# EAGLE design frequency divider 1.2 (EAGLE 6.4)
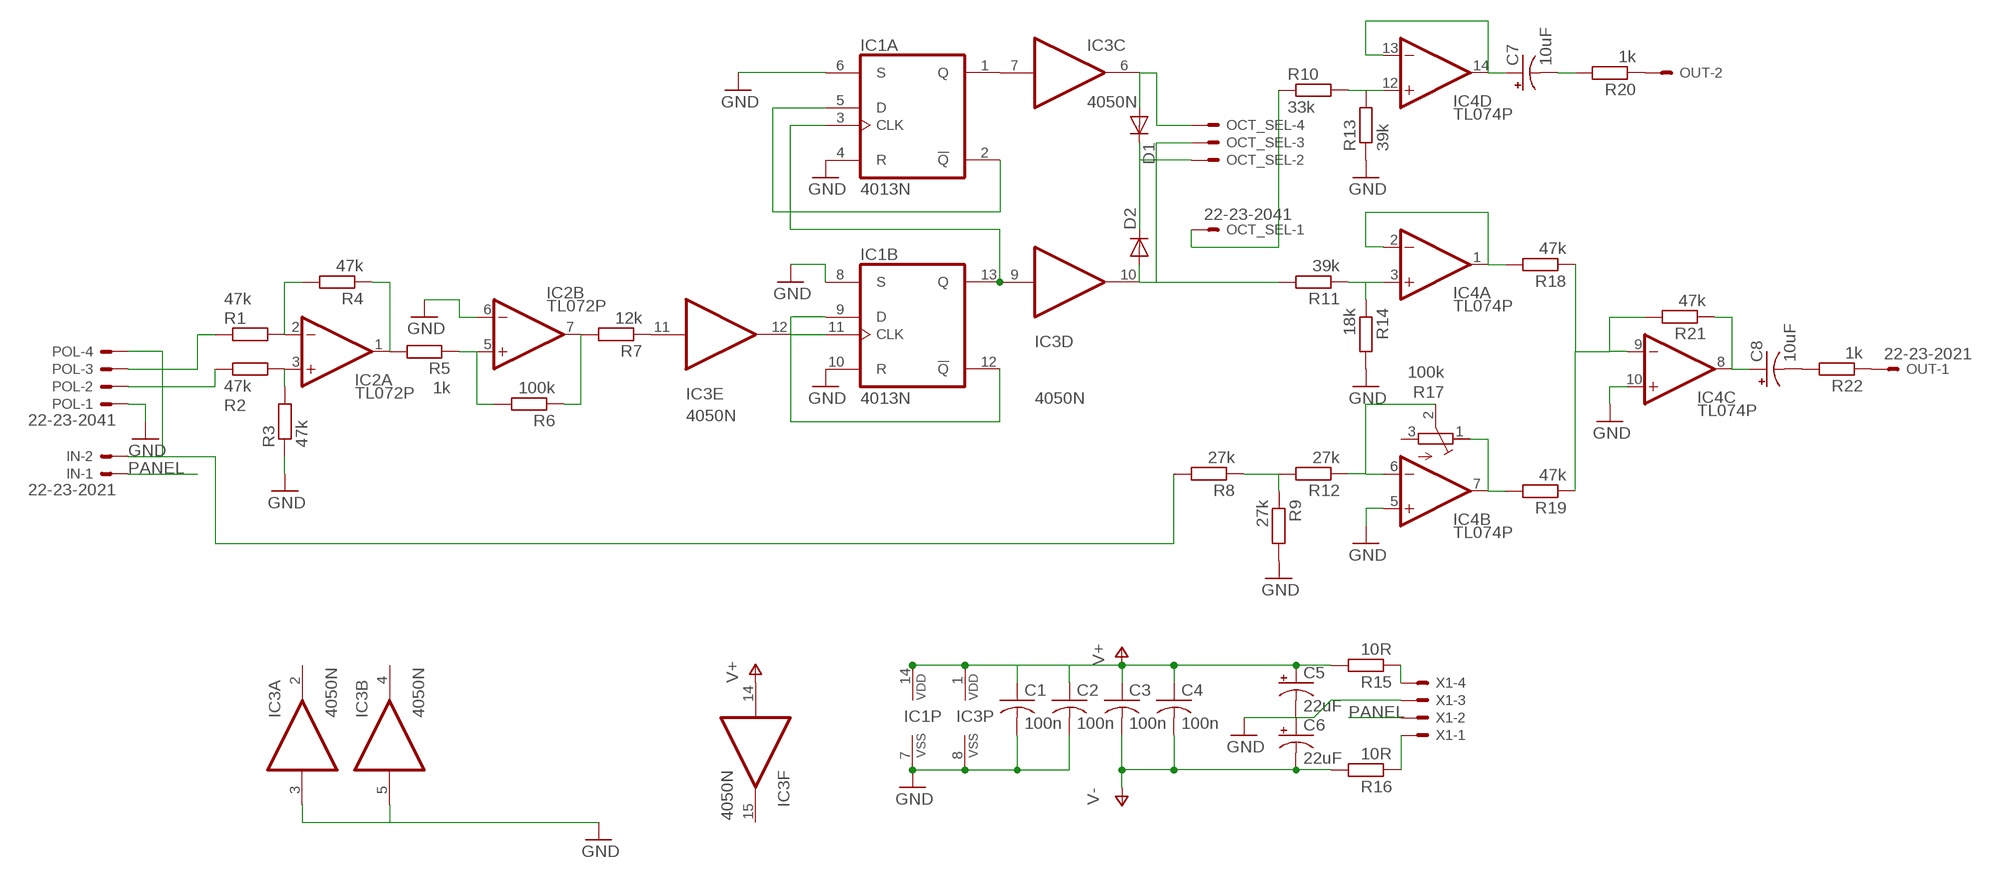
[diagram p0: schematic, sheet 1]

## Parts
C1  100n  C-US025-024X044  [C025-024X044]
C2  100n  C-US025-024X044  [C025-024X044]
C3  100n  C-US025-024X044  [C025-024X044]
C4  100n  C-US025-024X044  [C025-024X044]
C5  22uF  CPOL-USE2.5-5  [E2,5-5]
C6  22uF  CPOL-USE2.5-5  [E2,5-5]
C7  10uF  CPOL-USE2.5-5  [E2,5-5]
C8  10uF  CPOL-USE2.5-5  [E2,5-5]
D1  DIODE-D-5  [D-5]
D2  DIODE-D-5  [D-5]
IC1  4013N  [DIL14]
IC2  TL072P  [DIL08]
IC3  4050N  [DIL16]
IC4  TL074P  [DIL14]
IN  22-23-2021  [22-23-2021]
OCT_SEL  22-23-2041  [22-23-2041]
OUT  22-23-2021  [22-23-2021]
POL  22-23-2041  [22-23-2041]
R1  47k  R-EU_0204/7  [0204/7]
R2  47k  R-EU_0204/7  [0204/7]
R3  47k  R-EU_0204/7  [0204/7]
R4  47k  R-EU_0204/7  [0204/7]
R5  1k  R-EU_0204/7  [0204/7]
R6  100k  R-EU_0204/7  [0204/7]
R7  12k  R-EU_0204/7  [0204/7]
R8  27k  R-EU_0204/7  [0204/7]
R9  27k  R-EU_0204/7  [0204/7]
R10  33k  R-EU_0204/7  [0204/7]
R11  39k  R-EU_0204/7  [0204/7]
R12  27k  R-EU_0204/7  [0204/7]
R13  39k  R-EU_0204/7  [0204/7]
R14  18k  R-EU_0204/7  [0204/7]
R15  10R  R-EU_0204/7  [0204/7]
R16  10R  R-EU_0204/7  [0204/7]
R17  100k  R-TRIMMT93YA  [RTRIMT93YA]
R18  47k  R-EU_0204/7  [0204/7]
R19  47k  R-EU_0204/7  [0204/7]
R20  1k  R-EU_0204/7  [0204/7]
R21  47k  R-EU_0204/7  [0204/7]
R22  1k  R-EU_0204/7  [0204/7]
X1  KK-156-4  [KK-156-4]

## Nets
GND: C1.2 C2.2 C5.- C6.+ IC1.4(A:R) IC1.6(A:S) IC1.7(P:VSS) IC1.8(B:S) IC1.10(B:R) IC2.6(B:-IN) IC3.3(A:I) IC3.5(B:I) IC3.8(P:VSS) IC4.5(B:+IN) IC4.10(C:+IN) POL.1 R3.1 R9.2 R13.1 R14.2 X1.3
N$1: C7.- R20.2
N$2: C8.- R22.2
N$3: IC2.2(A:-IN) R1.2 R4.2
N$4: IC2.3(A:+IN) R2.2 R3.2
N$5: IC2.1(A:OUT) R4.1 R5.2
N$6: IC1.3(A:CLK) IC1.13(B:Q) IC3.9(D:I)
N$7: IC2.5(B:+IN) R5.1 R6.2
N$8: IC2.7(B:OUT) R6.1 R7.2
N$9: IC3.11(E:I) R7.1
N$10: IC1.11(B:CLK) IC3.12(E:O)
N$11: IC1.9(B:D) IC1.12(B:!Q)
N$12: D2.A IC3.10(D:O) OCT_SEL.3 R11.2
N$13: IC4.3(A:+IN) R11.1 R14.1
N$14: IC4.12(D:+IN) R10.2 R13.2
N$15: C7.+ IC4.13(D:-IN) IC4.14(D:OUT)
N$16: IC4.1(A:OUT) IC4.2(A:-IN) R18.2
N$17: IC4.6(B:-IN) R12.1 R17.2(S)
N$18: IC4.7(B:OUT) R17.1(A) R19.2
N$19: R15.1 X1.4
N$20: R8.1 R9.1 R12.2
N$21: IC4.9(C:-IN) R18.1 R19.1 R21.2
N$22: C8.+ IC4.8(C:OUT) R21.1
N$23: R16.1 X1.1
N$24: OUT.2 R20.1
N$25: IN.2 POL.4 R8.2
N$26: OUT.1 R22.1
N$31: POL.2 R2.1
N$32: POL.3 R1.1
N$33: IC1.2(A:!Q) IC1.5(A:D)
N$34: IC1.1(A:Q) IC3.7(C:I)
N$36: D1.A IC3.6(C:O) OCT_SEL.4
N$37: D1.C D2.C OCT_SEL.2
N$38: OCT_SEL.1 R10.1
PANEL: IN.1 X1.2
V+: C1.1 C2.1 C3.1 C4.1 C5.+ IC1.14(P:VDD) IC3.1(P:VDD) IC3.14(F:I) R15.2
V-: C3.2 C4.2 C6.- R16.2
Unconnected: IC3.2(A:O) IC3.4(B:O) IC3.15(F:O) R17.3(E)

## Power pins joined to a net without a drawn wire
V+: IC2.8(P:V+) IC4.4(P:V+)
V-: IC2.4(P:V-) IC4.11(P:V-)

## Library data of the parts
C1-C4 = resistor:C-US: CAPACITOR, American symbol
C5-C8 = resistor:CPOL-US: POLARIZED CAPACITOR, American symbol
D1 D2 = diode:DIODE-: DIODE
IC1 = joakim:4013: Dual D FLIP FLOP, set/reset
IC2 = linear:TL072: OP AMP
IC3 = joakim:4050: Hex non-inverting BUFFER
IC4 = linear:TL074: OP AMP
IN OUT = con-molex:22-23-2021: .100" (2.54mm) Center Header - 2 Pin; MF: MOLEX; MPN: 22-23-2021; OC_FARNELL: 1462926; OC_NEWARK: 25C3832
OCT_SEL POL = con-molex:22-23-2041: .100" (2.54mm) Center Header - 4 Pin; MF: MOLEX; MPN: 22-23-2041; OC_FARNELL: 1462920; OC_NEWARK: 38C0355
R1-R10 R12-R16 R18-R22 = joakim:R-EU_: RESISTOR, European symbol
R11 = resistor:R-EU_: RESISTOR, European symbol
R17 = resistor:R-TRIMM: Trimm resistor
X1 = con-molex:KK-156-4: KK 156 HEADER Source: http://www.molex.com/pdm_docs/sd/026604100_sd.pdf; OC_FARNELL: unknown; OC_NEWARK: unknown

## Board
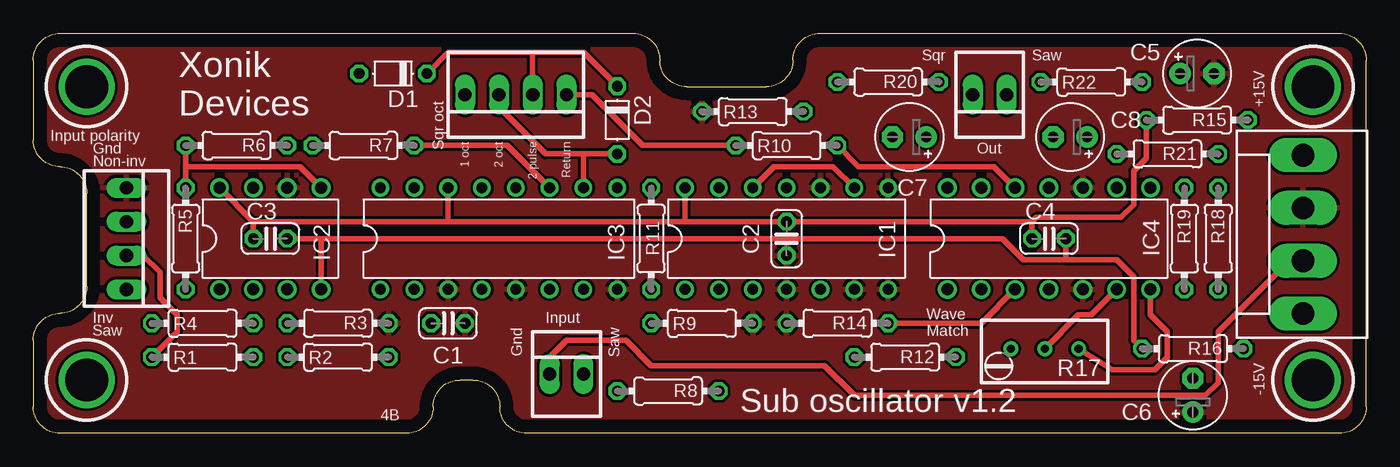
[diagram p1: board, top side]
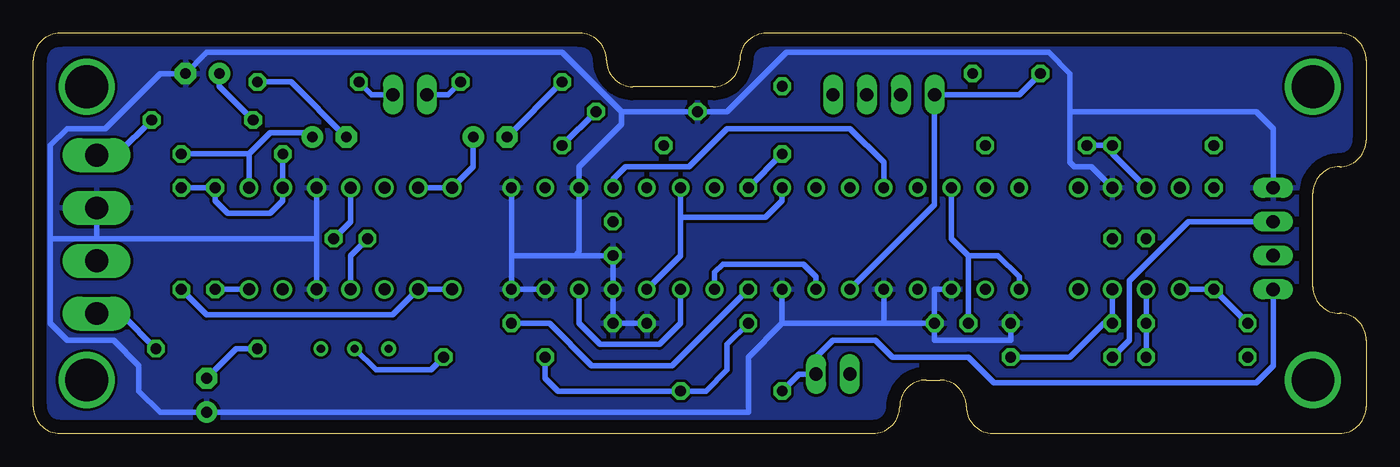
[diagram p2: board, bottom side, seen from below]

Size 100 x 30 mm. Coordinates in mm from the lower left corner, seen from the top.
Outline: 0,28 arc-90 2,30 45,30 arc-90 47,28 arc90 49,26 55,26 arc90 57,28 arc-90 59,30 98,30 arc-90 100,28 100,2 arc-90 98,0 37,0 arc-90 35,2 arc90 33,4 32,4 arc90 30,2 arc-90 28,0 2,0 arc-90 0,2 0,7 arc-90 2,9 arc90 4,11 4,18 arc90 2,20 arc-90 0,22 0,28
Copper layers (1*16): Top 0.035mm / dielectric 1.5mm / Bottom 0.035mm
Design rules "default": minimum track width 10mil, minimum drill 24mil, track to track 8mil, track to pad 8mil, pad to pad 8mil, via to via 8mil, smd to smd 8mil, copper to edge 40mil, drill to drill 8mil, minimum pad ring 10mil, minimum via ring 8mil, stop-mask expansion 4mil, vias tented up to drill 0mil, thermal gap 10mil

### Footprints (pad centres in the part's own frame; a part is rotated, then mirrored left to right if it is on the bottom)
C025-024X044 = drill 0.813 octagon: 1 -1.27,0; 2 1.27,0
E2,5-5 = drill 0.813 pad 1.6: + -1.27,0 | drill 0.813 pad 1.6 octagon: - 1.27,0
D-5 = drill 0.813 octagon: A 2.54,0; C -2.54,0
DIL14 = drill 0.813: 1 -7.62,-3.81; 2 -5.08,-3.81; 3 -2.54,-3.81; 4 0,-3.81; 5 2.54,-3.81; 6 5.08,-3.81; 7 7.62,-3.81; 8 7.62,3.81; 9 5.08,3.81; 10 2.54,3.81; 11 0,3.81; 12 -2.54,3.81; 13 -5.08,3.81; 14 -7.62,3.81
DIL08 = drill 0.9: 1 -3.81,-3.81; 2 -1.27,-3.81; 3 1.27,-3.81; 4 3.81,-3.81; 5 3.81,3.81; 6 1.27,3.81; 7 -1.27,3.81; 8 -3.81,3.81
DIL16 = drill 0.813: 1 -8.89,-3.81; 2 -6.35,-3.81; 3 -3.81,-3.81; 4 -1.27,-3.81; 5 1.27,-3.81; 6 3.81,-3.81; 7 6.35,-3.81; 8 8.89,-3.81; 9 8.89,3.81; 10 6.35,3.81; 11 3.81,3.81; 12 1.27,3.81; 13 -1.27,3.81; 14 -3.81,3.81; 15 -6.35,3.81; 16 -8.89,3.81
DIL14' = drill 0.9: 1 -7.62,-3.81; 2 -5.08,-3.81; 3 -2.54,-3.81; 4 0,-3.81; 5 2.54,-3.81; 6 5.08,-3.81; 7 7.62,-3.81; 8 7.62,3.81; 9 5.08,3.81; 10 2.54,3.81; 11 0,3.81; 12 -2.54,3.81; 13 -5.08,3.81; 14 -7.62,3.81
22-23-2021 = drill 1 long: 1 -1.27,0; 2 1.27,0
22-23-2041 = drill 1 long: 1 -3.81,0; 2 -1.27,0; 3 1.27,0; 4 3.81,0
0204/7 = drill 0.813 octagon: 1 -3.81,0; 2 3.81,0
RTRIMT93YA = drill 0.61: 1 0,-2.54; 2 0,0; 3 0,2.54
KK-156-4 = drill 1.7 pad 2.184 long: 1 -5.94,0; 2 -1.98,0; 3 1.98,0; 4 5.94,0

### Placement (x,y rotation side)
C1  31.11,8.26 0 top
C2  56.52,14.61 270 top
C3  17.78,14.61 0 top
C4  76.2,14.61 0 top
C5  87.31,26.99 0 top
C6  87,2.86 90 top
C7  65.72,22.23 180 top
C8  77.79,22.23 180 top
D1  26.99,26.99 180 top
D2  43.81,23.5 270 top
IC1  56.52,14.61 0 top
IC2  17.78,14.61 0 top
IC3  34.92,14.61 0 top
IC4  TL074P  [DIL14']  76.2,14.61 0 top
IN  40.01,4.45 0 top
OCT_SEL  36.2,25.4 180 top
OUT  71.75,25.4 180 top
POL  6.99,14.61 270 top
R1  12.7,5.71 0 top
R2  22.86,5.71 0 top
R3  22.86,8.26 180 top
R4  12.7,8.26 0 top
R5  11.43,14.61 270 top
R6  15.24,21.59 180 top
R7  24.77,21.59 180 top
R8  47.62,3.17 180 top
R9  50.16,8.26 0 top
R10  56.52,21.59 0 top
R11  46.35,14.61 90 top
R12  65.41,5.71 180 top
R13  53.98,24.13 0 top
R14  60.33,8.26 180 top
R15  87.31,23.5 180 top
R16  87,6.35 180 top
R17  75.88,6.35 90 top
R18  88.9,14.61 270 top
R19  86.36,14.61 270 top
R20  64.14,26.35 180 top
R21  85.09,20.95 180 top
R22  79.38,26.35 0 top
X1  95.25,14.92 90 top

### Tracks (layer width: path | path; a pad name or v marks a point on that pad's centre or on a via)
GND
  Bottom 0.406: 43.81,8.26 36.2,8.26 | 36.2,8.26 C1.2 | 55.88,24.13 55.88,23.18 59.05,20 IC1.10 59.05,13.65 59.37,13.34 | R3.1 26.67,6.99 32.38,6.99 C1.2 | IC2.6 20.64,20 21.91,20 22.23,20.32 22.23,24.13 | 22.23,24.13 8.26,24.13 6.99,22.86 POL.1 | 43.81,8.26 46.35,5.71 46.35,1.59 C6.+ 90.49,1.59 92.08,3.17 92.08,5.08 93.98,6.99 97.47,6.99 98.74,8.26 98.74,14.61 | 22.23,24.13 22.23,26.99 23.81,28.57 43.5,28.57 47.94,24.13 R13.1 55.88,24.13 | IC4.10 78.74,14.61 | 78.74,14.61 IC4.5 | 98.74,14.61 98.74,21.59 97.47,22.86 94.61,22.86 90.49,26.99 C5.- 87,28.57 60.33,28.57 55.88,24.13 | X1.3 95.25,14.61 | 95.25,14.61 78.74,14.61 | 95.25,14.61 98.74,14.61 | IC3.8 43.81,8.26 | C1.2 32.38,10.79 IC3.3 | IC3.5 36.2,8.26 | R9.2 R14.2 IC1.4 C2.2 59.37,13.34 | IC1.6 IC1.7 64.14,13.34 | 59.37,13.34 64.14,13.34 | 64.14,13.34 IC1.8
  pour Top: 0,30 100,30 100,0 0,0
  pour Bottom: 0,30 100,30 100,0 0,0
N$1
  Bottom 0.406: R20.2 C7.-
N$2
  Bottom 0.406: R22.2 80.64,26.35 C8.-
N$3
  Bottom 0.406: IC2.2 R4.2 R1.2
N$4
  Bottom 0.406: IC2.3 R3.2 19.68,8.26 22.23,5.71 R2.2
N$5
  Bottom 0.406: R4.1 R5.2 IC2.1
N$6
  Bottom 0.406: IC1.13 51.44,16.19 | 51.44,16.19 45.09,16.19 43.81,17.46 IC3.9 | 51.44,16.19 51.44,13.34 IC1.3
N$7
  Top 0.406: R5.1 11.43,20 | 11.43,20 20,20 IC2.5 | R6.2 11.43,20
N$8
  Bottom 0.406: IC2.7 19.05,20.95 R6.1 R7.2
N$9
  Top 0.406: R7.1 35.56,21.59 IC3.11
N$10
  Bottom 0.406: IC1.11 56.52,19.05 55.56,20 50.8,20 47.94,22.86 38.73,22.86 36.2,20.32 IC3.12
N$11
  Top 0.406: IC1.12 55.56,20 60.01,20 IC1.9
N$12
  Top 0.406: D2.A 41.27,20.95 | 41.27,20.95 38.42,20.95 34.92,24.45 OCT_SEL.3 | IC3.10 41.27,20.95
  Bottom 0.406: D2.A R11.2
N$13
  Top 0.406: R14.1 71.12,8.26 IC4.3
  Bottom 0.406: R11.1 52.07,5.08 58.1,5.08 61.28,8.26 R14.1
N$14
  Top 0.406: R10.2 61.91,20 72.07,20 IC4.12
  Bottom 0.406: R13.2 R10.2
N$15
  Bottom 0.406: IC4.13 IC4.14 66.99,20 C7.+
N$16
  Bottom 0.406: IC4.1 IC4.2 73.03,8.89 87,8.89 R18.2
N$17
  Top 0.406: R17.2 78.42,8.89 79.38,8.89 IC4.6
  Bottom 0.406: R12.1 70.17,4.76 74.3,4.76 R17.2
N$18
  Top 0.406: R17.1 80.96,4.76 84.14,4.76 85.09,5.71 85.09,7.62 83.82,8.89 IC4.7
  Bottom 0.406: IC4.7 R19.2
N$19
  Bottom 0.406: R15.1 93.66,20.95 95.16,20.95 X1.4
N$20
  Bottom 0.406: R12.2 61.59,4.13 60.64,3.17 R8.1 49.53,3.17 47.94,4.76 47.94,6.67 R9.1
N$21
  Bottom 0.406: R21.2 IC4.9 81.28,17.46 82.23,16.51 85.41,16.51 86.36,17.46 R19.1 R18.1
N$22
  Bottom 0.406: IC4.8 83.82,20.95 | 83.82,20.95 R21.1 | C8.+ 79.38,22.54 82.23,22.54 83.82,20.95
N$23
  Bottom 0.406: R16.1 93.34,8.89 95.16,8.89 X1.1
N$24
  Bottom 0.406: R20.1 68.9,25.4 OUT.2
N$25
  Bottom 0.406: R8.2 42.55,4.45 IN.2 41.27,5.71 40.01,6.99 36.83,6.99 35.56,5.71 29.84,5.71 27.94,3.81 8.26,3.81 6.99,5.08 POL.4
N$26
  Bottom 0.406: R22.1 74.61,25.4 OUT.1
N$27  (via drill 3.2)
  other vias: 4,4
N$28  (via drill 3.2)
  other vias: 4,26
N$29  (via drill 3.2)
  other vias: 96,26
N$30  (via drill 3.2)
  other vias: 96,4
N$31
  Bottom 0.406: R2.1 17.78,6.99 17.78,11.43 13.34,15.88 POL.2
N$32
  Top 0.406: R1.1 10.79,7.62 10.79,8.89 9.53,10.16 9.53,12.06 8.26,13.34 POL.3
N$33
  Bottom 0.406: IC1.2 51.44,8.26 53.02,6.67 57.47,6.67 59.05,8.26 IC1.5
N$34
  Bottom 0.406: IC1.1 48.9,12.06 48.26,12.7 42.23,12.7 41.27,11.75 IC3.7
N$36
  Bottom 0.406: D1.A 26.04,25.4 OCT_SEL.4 32.38,17.14 IC3.6
N$37
  Top 0.406: D1.C 31.11,28.57 37.47,28.57 | 37.47,28.57 41.27,28.57 D2.C | OCT_SEL.2 37.47,28.57
N$38
  Top 0.406: OCT_SEL.1 41.91,25.4 45.72,21.59 R10.1
PANEL
  Top 0.406: IN.1 38.73,5.71 40.01,6.99 44.45,6.99 46.35,5.08 59.37,5.08 61.59,2.86 87.95,2.86 88.9,3.81 88.9,7.62 94.3,13.02 95.17,13.02 X1.2
V+
  Top 0.406: R15.2 83.5,20.64 82.55,19.68 82.55,17.14 81.6,16.19 75.25,16.19 74.93,15.88 | 74.93,15.88 C4.1 | 74.93,15.88 C2.1 48.9,15.88 | 48.9,15.88 31.11,15.88 | 31.11,15.88 16.51,15.88 | 16.51,15.88 IC2.8 | C3.1 16.51,15.88 | IC3.14 31.11,15.88 | IC1.14 48.9,15.88
  Bottom 0.406: C1.1 29.84,13.34 | R15.2 86.04,26.04 C5.+ | C4.1 76.2,13.34 IC4.4 | IC3.1 26.04,11.75 27.62,13.34 29.84,13.34 | 29.84,13.34 31.11,14.61 IC3.14
V-
  Top 0.406: C4.2 77.47,13.02 | 77.47,13.02 81.28,13.02 82.55,11.75 82.55,6.99 R16.2 | 77.47,13.02 74.3,13.02 72.71,14.61 21.59,14.61 | C3.2 21.59,14.61 | 21.59,14.61 IC2.4
  Bottom 0.406: C4.2 76.2,15.88 IC4.11 | R16.2 84.77,6.35 C6.-

### Text on the board
tNames: Sqr | Saw | Xonik / Devices | +15V | Input polarity | 1 oct | 2 oct | 2 pulse | Return | Gnd | Sqr oct | Out | Non-inv | Inv | Gnd | Input | Saw | Saw | Wave / Match | -15V | Sub oscillator v1.2 | 4B